# EAGLE schematic circuit (EAGLE 7.1.0)
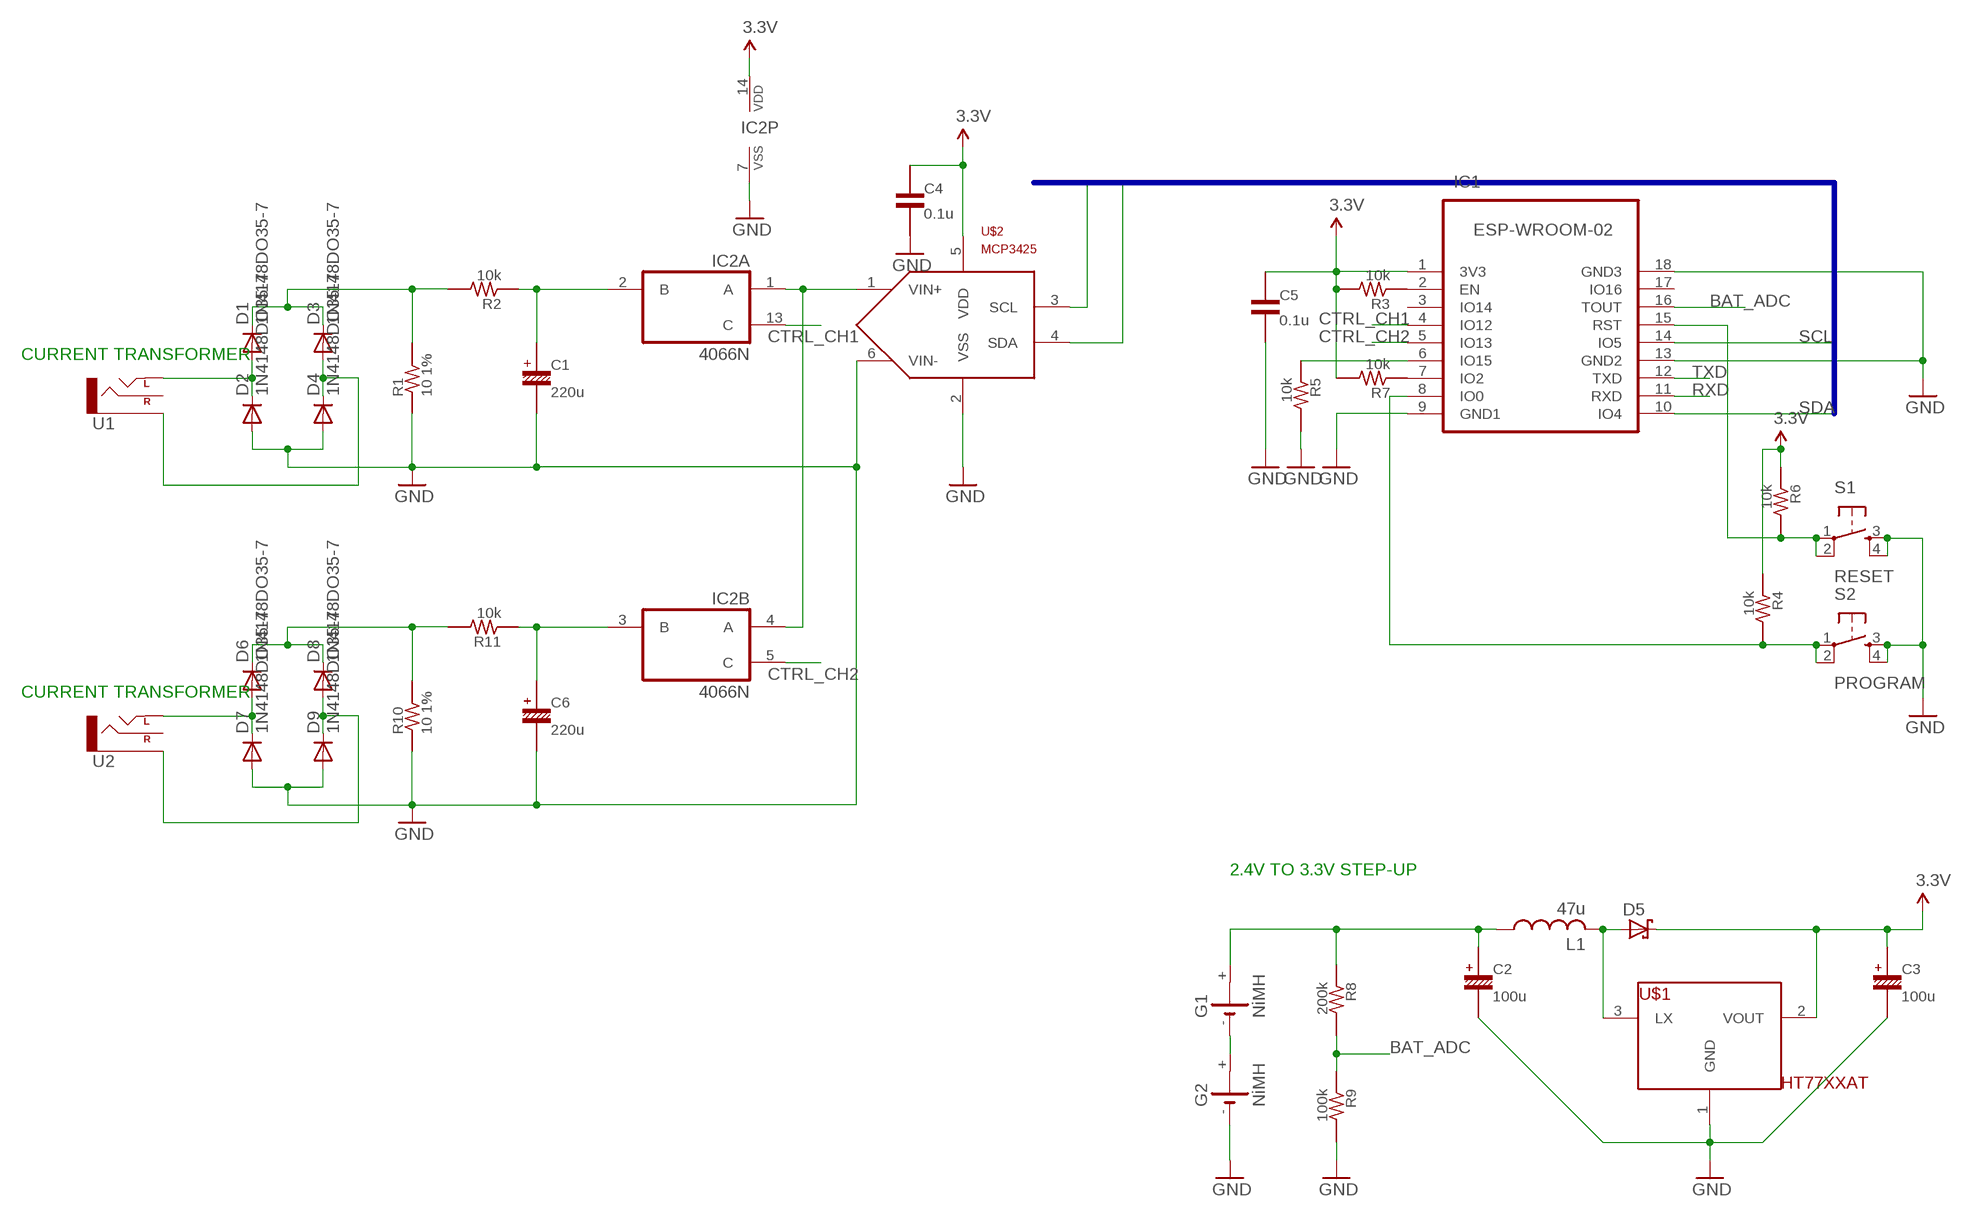
[diagram p0: schematic, sheet 1]

## Parts
C1  220u  CE-16V-04-2.54  [16V-4-2.54]
C2  100u  CE-16V-06.3-5.08  [16V-6.3-5.08]
C3  100u  CE-16V-06.3-5.08  [16V-6.3-5.08]
C4  0.1u  C-50V-0302-2.54  [50-0302-2.54]
C5  0.1u  C-50V-0302-2.54  [50-0302-2.54]
C6  220u  CE-16V-04-2.54  [16V-4-2.54]
D1  1N4148DO35-7  [DO35-7]
D2  1N4148DO35-7  [DO35-7]
D3  1N4148DO35-7  [DO35-7]
D4  1N4148DO35-7  [DO35-7]
D5  SCHOTTKY-DIODEDO35-7  [DO35-7]
D6  1N4148DO35-7  [DO35-7]
D7  1N4148DO35-7  [DO35-7]
D8  1N4148DO35-7  [DO35-7]
D9  1N4148DO35-7  [DO35-7]
G1  NiMH  CRAA  [CRAA]
G2  NiMH  CRAA  [CRAA]
IC1  ESP-WROOM-02  [ESP-WROOM-02]
IC2  4066N  [DIL14]
L1  47u  L-US6000-XXX-RC  [6000-XXXX-RC]
R1  10 1%  R-1/4W-07.62  [1/4W-7.62H]
R2  10k  R-1/4W-07.62  [1/4W-7.62H]
R3  10k  R-1/4W-07.62  [1/4W-7.62H]
R4  10k  R-1/4W-07.62  [1/4W-7.62H]
R5  10k  R-1/4W-07.62  [1/4W-7.62H]
R6  10k  R-1/4W-07.62  [1/4W-7.62H]
R7  10k  R-1/4W-07.62  [1/4W-7.62H]
R8  200k  R-1/4W-07.62  [1/4W-7.62H]
R9  100k  R-1/4W-07.62  [1/4W-7.62H]
R10  10 1%  R-1/4W-07.62  [1/4W-7.62H]
R11  10k  R-1/4W-07.62  [1/4W-7.62H]
S1  RESET  TAC_SWITCHPTH  [TACTILE-PTH]
S2  PROGRAM  TAC_SWITCHPTH  [TACTILE-PTH]
U1  AUDIO-JACK2.5MM  [STEREOJACK2.5MM_STEREOJACK2.5MM]
U2  AUDIO-JACK2.5MM  [STEREOJACK2.5MM_STEREOJACK2.5MM]
U$1  HT77XXAT  [TO-92]
U$2  MCP3425  [SOT-23-6]

## Nets
3.3V: C3.+ C4.PAD1 C5.PAD1 D5.C IC1.1(3V3) IC2.14(P:VDD) R3.PAD2 R4.PAD1 R6.PAD1 R7.PAD2 U$1.2(VOUT) U$2.5(VDD)
BAT_ADC: IC1.16(TOUT) R8.PAD2 R9.PAD1
CTRL_CH1: IC1.4(IO12) IC2.13(A:C)
CTRL_CH2: IC1.5(IO13) IC2.5(B:C)
GND: C1.- C2.- C3.- C4.PAD2 C5.PAD2 C6.- D2.A D4.A D7.A D9.A G2.- IC1.9(GND1) IC1.13(GND2) IC1.18(GND3) IC2.7(P:VSS) R1.PAD1 R5.PAD2 R9.PAD2 R10.PAD1 S1.3 S1.4 S2.3 S2.4 U$1.1(GND) U$2.2(VSS) U$2.6(VIN-)
N$1: C1.+ IC2.2(A:B) R2.PAD1
N$2: IC1.2(EN) R3.PAD1
N$3: D1.A D2.C U1.SHIELD(LEFT)
N$4: D3.A D4.C U1.RING1(SLEEVE)
N$5: D1.C D3.C R1.PAD2 R2.PAD2
N$6: IC1.6(IO15) R5.PAD1
N$7: IC1.7(IO2) R7.PAD1
N$8: IC1.8(IO0) R4.PAD2 S2.1 S2.2
N$9: IC1.15(RST) R6.PAD2 S1.1 S1.2
N$10: G1.- G2.+
N$11: D5.A L1.2 U$1.3(LX)
N$12: D6.A D7.C U2.SHIELD(LEFT)
N$13: C2.+ G1.+ L1.1 R8.PAD1
N$14: IC2.1(A:A) IC2.4(B:A) U$2.1(VIN+)
N$15: D8.A D9.C U2.RING1(SLEEVE)
N$16: D6.C D8.C R10.PAD2 R11.PAD2
N$17: C6.+ IC2.3(B:B) R11.PAD1
RXD: IC1.11(RXD)
SCL: IC1.14(IO5) U$2.3(SCL)
SDA: IC1.10(IO4) U$2.4(SDA)
TXD: IC1.12(TXD)
Unconnected: G1.+@1(+) G2.+@1(+) IC1.3(IO14) IC1.17(IO16) IC2.6(C:C) IC2.8(C:A) IC2.9(C:B) IC2.10(D:B) IC2.11(D:A) IC2.12(D:C) U1.TIP(RIGHT) U2.TIP(RIGHT)

## Buses
SCL,SDA

## Notes on the sheet
- CURRENT TRANSFORMER
- CURRENT TRANSFORMER
- 2.4V TO 3.3V STEP-UP

## Library data of the parts
C1-C3 C6 = my:CE-: ELECTROLYTIC CAPACITOR Japanese symbol
C4 C5 = my:C-: CAPACITOR Japanese symbol
D1-D4 D6-D9 = diode:1N4148: DIODE high speed (Philips)
D5 = diode:SCHOTTKY-DIODE: Schottky Diode
G1 G2 = battery:CRAA: LI BATTERY Varta
IC1 = my:ESP-WROOM-02: WiFi module - ESP-WROOM-02
IC2 = 40xx:4066: Quad bilateral ANALOG SWITCH
L1 = rcl:L-US: INDUCTOR, American symbol
R1-R11 = my:R-: RESISTOR Japanese symbol
S1 S2 = SparkFun-Electromechanical:TAC_SWITCH: Momentary Switch Button commonly used for reset or general input. Spark Fun Electronics SKU : COM-00097 SMT- SWCH-08247
U1 U2 = SparkFun-Connectors:AUDIO-JACK: 3.5mm Audio Jack Simple 3.5mm common PCB mount audio jack. SKU: PRT-08032
U$1 = my:HT77XXA
U$2 = my:MCP3425